# Altium schematic sheet 9-FlowSensor.SchDoc
size A4; Author: Fabian Castaño; CompanyName: UdeA; Engineer: Fabian Castaño; Organization: Universidad de Antioquia; Address1: UdeA; Address2: Medellín; Address3: Antioquia; Address4: Colombia 050010; DocumentNumber: 10; Revision: Jaime Osorio; SheetNumber: 10; SheetTotal: 12
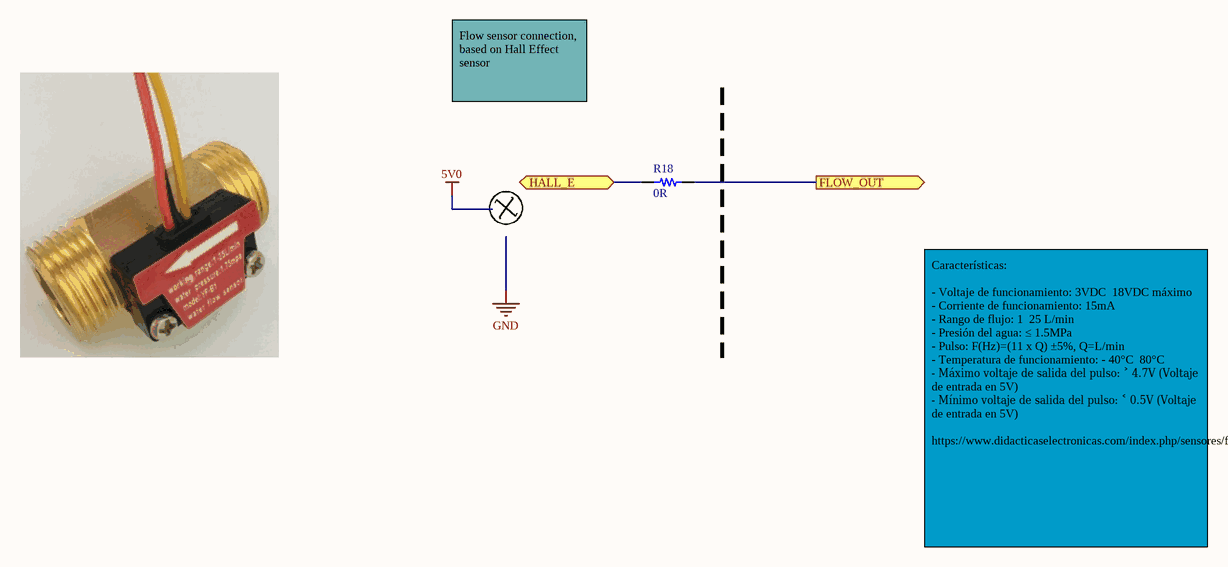
[diagram p0: 9-FlowSensor.SchDoc]

## Parts
R18  0R  [RES 0805_2012]

## Ports
FLOW_OUT (out), HALL_E

## Nets
FLOW_OUT: R18.1 ; port FLOW_OUT
HALL_E: R18.2 ; port HALL_E

## Notes on the sheet
- Flow sensor connection, based on Hall Effect sensor
- Características:
  - Voltaje de funcionamiento: 3VDC  18VDC máximo
  - Corriente de funcionamiento: 15mA
  - Rango de flujo: 1  25 L/min
  - Presión del agua: ≤ 1.5MPa
  - Pulso: F(Hz)=(11 x Q) ±5%, Q=L/min
  - Temperatura de funcionamiento: - 40°C  80°C
  - Máximo voltaje de salida del pulso: ˃ 4.7V (Voltaje de entrada en 5V)
  - Mínimo voltaje de salida del pulso: ˂ 0.5V (Voltaje de entrada en 5V)
  https://www.didacticaselectronicas.com/index.php/sensores/flujo-y-nivel/sensor-de-flujo-de-agua-media-pulgada-lat%C3%B3n-yf-b1-v%C3%A1lvulas-sensores-de-flujo-de-fluido-de-agua-media-pulgada-detail
- Title
- Size:
- Date:
- A4
- Enginner:
- Time:
- Revision:
- Sheet
- of
- Author:
- File:

## Library data of the parts
R18 = RC0805FR-071K47L: RES SMD 1.47K OHM 1% 1/8W 0805; Manufacturer: Yageo; Power (Watts): 0.125W, 1/8W; Resistance: 1.47 kOhms; Temperature Coefficient: ±100ppm/°C; Part Number: RC0805FR-071K47L; Value: 0R; ComponentLink1Description: Datasheet; ComponentLink1URL: https://www.yageo.com/upload/media/product/productsearch/datasheet/rchip/PYu-RC_Group_51_RoHS_L_10.pdf; ComponentLink2Description: DigiKey Link; ComponentLink2URL: http://digikey.com/product-detail/en/yageo/RC0805FR-071K47L/311-1.47KCRCT-ND/730440; Composition: Thick Film; Device Package: 0805 (2012 Metric); Features: Moisture Resistant; Height - Seated (Max): 0.024" (0.60mm); LastUpdated: 2/09/2020 01:14:46; Lifecycle Status: Active; Minimum Order: 1; Number of Terminations: 2; Operating Temperature: -55°C ~ 155°C; Package / Case: 0805 (2012 Metric); Packaging: CutTape; PartId: 44768; Part Status: Active; Price: 0.10; Series: RC; Size / Dimension: 0.079" L x 0.049" W (2.00mm x 1.25mm); Supplier 1: DigiKey; Supplier Part Number 1: 311-1.47KCRCT-ND; Supplier Device Package: 0805; Tolerance: ±1%